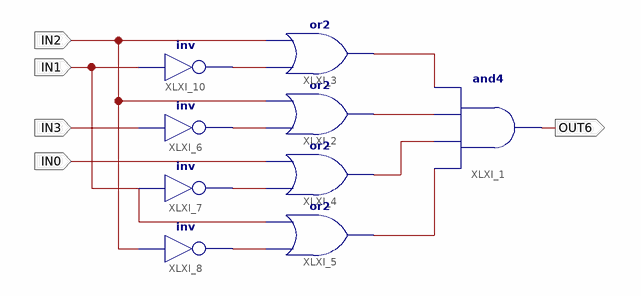
[diagram p0: schematic sheet 1]
// Xilinx ISE schematic Segmento6.sch (spartan3e) as structural Verilog: 9 symbols, 5 ports
module Segmento6 (
  input  IN0,
  input  IN2,
  input  IN3,
  input  IN1,
  output OUT6
);

  wire XLXN_1, XLXN_2, XLXN_3, XLXN_4, XLXN_20, XLXN_23, XLXN_24, XLXN_27;

  and XLXI_1 (OUT6, XLXN_4, XLXN_3, XLXN_2, XLXN_1);
  or XLXI_2 (XLXN_2, XLXN_20, IN2);
  or XLXI_3 (XLXN_1, XLXN_27, IN2);
  or XLXI_4 (XLXN_3, XLXN_23, IN0);
  or XLXI_5 (XLXN_4, XLXN_24, IN1);
  not XLXI_6 (XLXN_20, IN3);
  not XLXI_7 (XLXN_23, IN1);
  not XLXI_8 (XLXN_24, IN2);
  not XLXI_10 (XLXN_27, IN1);
endmodule
